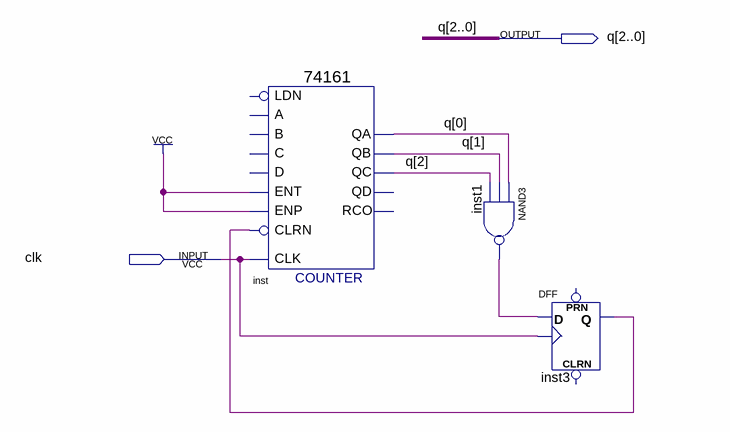
[diagram p0: schematic sheet]
// Quartus schematic counter8.bdf as structural Verilog: 3 symbols, 2 pins
module counter8 (
  input  clk,
  output [2:0] q
);

  wire inst1_out, inst3_q;

  \74161  inst (
    .CLRN(inst3_q), .CLK(clk), .ENP(1'b1), .ENT(1'b1), .QC(q[2]), .QB(q[1]), .QA(q[0]));  // open: LDN, A, D, B, C, QD, RCO
  nand inst1 (inst1_out, q[0], q[1], q[2]);
  DFF inst3 (.CLK(clk), .D(inst1_out), .Q(inst3_q));  // open: CLRN, PRN
endmodule
